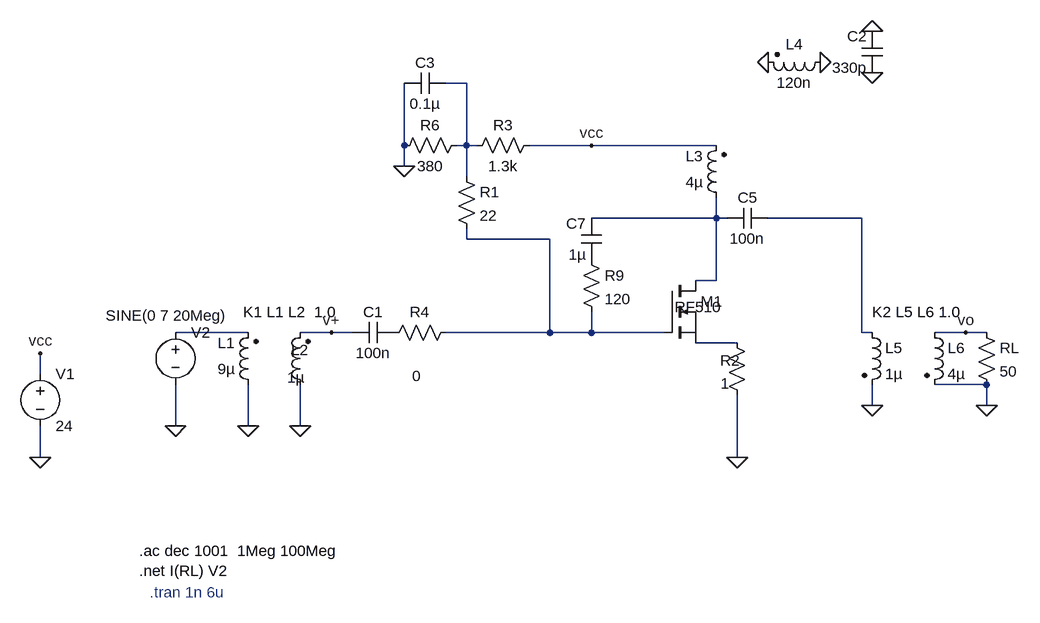
[diagram p0: schematic irf510_driver.asc]
irf510_driver.asc, the LTspice schematic file:
Version 4
SHEET 1 1172 704
WIRE 304 -96 272 -96
WIRE 208 0 208 -96
WIRE 304 0 304 -96
WIRE 304 0 288 0
WIRE 320 0 304 0
WIRE 496 0 400 0
WIRE 688 0 496 0
WIRE 208 32 208 0
WIRE 304 48 304 0
WIRE 688 112 688 80
WIRE 688 112 496 112
WIRE 704 112 688 112
WIRE 912 112 768 112
WIRE 304 144 304 128
WIRE 432 144 304 144
WIRE 688 208 688 112
WIRE 688 208 656 208
WIRE -32 288 -144 288
WIRE 96 288 48 288
WIRE 128 288 96 288
WIRE 432 288 432 144
WIRE 432 288 272 288
WIRE 496 288 496 256
WIRE 496 288 432 288
WIRE 608 288 496 288
WIRE 912 288 912 112
WIRE 928 288 912 288
WIRE 1072 288 1024 288
WIRE 1104 288 1072 288
WIRE 720 304 656 304
WIRE -352 352 -352 320
WIRE 1104 368 1024 368
WIRE 928 400 928 368
WIRE 1104 400 1104 368
WIRE -144 432 -144 368
WIRE -32 432 -32 368
WIRE 48 432 48 368
WIRE -352 480 -352 432
WIRE 720 480 720 384
FLAG -352 320 vcc
FLAG 496 0 vcc
FLAG -352 480 0
FLAG -144 432 0
FLAG -32 432 0
FLAG 1104 400 0
FLAG 1072 288 vo
FLAG 96 288 v+
FLAG 720 480 0
FLAG 48 432 0
FLAG 928 400 0
FLAG 208 32 0
FLAG 928 -112 0
FLAG 848 -128 0
FLAG 768 -128 0
FLAG 928 -176 0
DATAFLAG 352 288 "$"
DATAFLAG 704 304 "$"
DATAFLAG 688 176 "$"
SYMBOL ind2 -16 384 R180
WINDOW 0 36 80 Left 2
WINDOW 3 36 40 Left 2
SYMATTR InstName L1
SYMATTR Value 9µ
SYMATTR Type ind
SYMBOL ind2 64 384 R180
WINDOW 0 3 69 Left 2
WINDOW 3 9 27 Left 2
SYMATTR InstName L2
SYMATTR Value 1µ
SYMATTR Type ind
SYMBOL cap 192 272 R90
WINDOW 0 0 32 VBottom 2
WINDOW 3 32 32 VTop 2
SYMATTR InstName C1
SYMATTR Value 100n
SYMBOL res 288 32 R0
SYMATTR InstName R1
SYMATTR Value 22
SYMBOL voltage -352 336 R0
SYMATTR InstName V1
SYMATTR Value 24
SYMBOL res 416 -16 R90
WINDOW 0 0 56 VBottom 2
WINDOW 3 32 56 VTop 2
SYMATTR InstName R3
SYMATTR Value 1.3k
SYMBOL cap 208 -80 R270
WINDOW 0 32 32 VTop 2
WINDOW 3 0 32 VBottom 2
SYMATTR InstName C3
SYMATTR Value 0.1µ
SYMBOL nmos 608 208 R0
WINDOW 3 9 41 Left 2
SYMATTR Value IRF510
SYMATTR InstName M1
SYMBOL ind2 912 272 R0
SYMATTR InstName L5
SYMATTR Value 1µ
SYMATTR Type ind
SYMBOL ind2 1008 272 R0
SYMATTR InstName L6
SYMATTR Value 4µ
SYMATTR Type ind
SYMBOL res 304 -16 R90
WINDOW 0 0 56 VBottom 2
WINDOW 3 32 56 VTop 2
SYMATTR InstName R6
SYMATTR Value 380
SYMBOL voltage -144 272 R0
WINDOW 3 -107 -10 Left 2
SYMATTR Value SINE(0 7 20Meg)
SYMATTR InstName V2
SYMATTR Value2 AC 1
SYMATTR SpiceLine Rser=50
SYMBOL res 1088 272 R0
SYMATTR InstName RL
SYMATTR Value 50
SYMBOL res 480 160 R0
SYMATTR InstName R9
SYMATTR Value 120
SYMBOL cap 512 176 R180
WINDOW 0 24 56 Left 2
WINDOW 3 24 8 Left 2
SYMATTR InstName C7
SYMATTR Value 1µ
SYMBOL res 704 288 R0
WINDOW 0 -10 43 Left 2
WINDOW 3 -9 78 Left 2
SYMATTR InstName R2
SYMATTR Value 1
SYMBOL ind2 864 -144 R90
WINDOW 0 4 56 VBottom 2
WINDOW 3 32 56 VTop 2
SYMATTR InstName L4
SYMATTR Value 120n
SYMATTR Type ind
SYMBOL cap 944 -112 R180
WINDOW 0 24 56 Left 2
WINDOW 3 24 8 Left 2
SYMATTR InstName C2
SYMATTR Value 330p
SYMBOL res 288 272 R90
WINDOW 0 0 56 VBottom 2
WINDOW 3 67 61 VTop 2
SYMATTR InstName R4
SYMATTR Value 0
SYMBOL cap 704 128 R270
WINDOW 0 32 32 VTop 2
WINDOW 3 0 32 VBottom 2
SYMATTR InstName C5
SYMATTR Value 100n
SYMBOL ind2 704 96 R180
WINDOW 0 36 80 Left 2
WINDOW 3 36 40 Left 2
SYMATTR InstName L3
SYMATTR Value 4µ
SYMATTR Type ind
TEXT -40 256 Left 2 !K1 L1 L2  1.0
TEXT 928 256 Left 2 !K2 L5 L6 1.0
TEXT -200 624 Left 2 !.ac dec 1001  1Meg 100Meg\n.net I(RL) V2
TEXT -184 688 Left 2 ;.tran 1n 6u

The netlist it stands for:
* irf510_driver.asc
L1 0 N005 9µ
L2 0 v+ 1µ
C1 P001 v+ 100n
R1 N001 N004 22
V1 vcc 0 24
R3 vcc N001 1.3k
C3 0 N001 0.1µ
M1 N002 N004 N006 N006 IRF510
L5 N003 0 1µ
L6 vo 0 4µ
R6 N001 0 380
V2 N005 0 SINE(0 7 20Meg) AC 1 Rser=50
RL vo 0 50
R9 P002 N004 120
C7 P002 N002 1µ
R2 N006 0 1
L4 0 0 120n
C2 0 0 330p
R4 N004 P001 0
C5 N002 N003 100n
L3 N002 vcc 4µ
.model NMOS NMOS
.model PMOS PMOS
.lib standard.mos
K1 L1 L2  1.0
K2 L5 L6 1.0
.ac dec 1001  1Meg 100Meg
.net I(RL) V2
* .tran 1n 6u
.backanno
.end